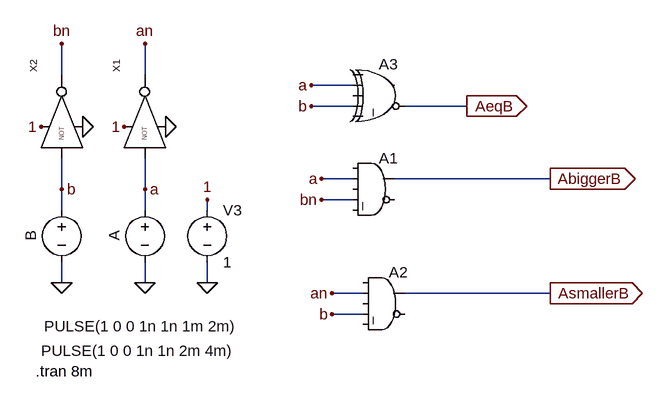
[diagram p0: schematic 1-bit comparator.asc]
1-bit comparator.asc, the LTspice schematic file:
Version 4
SHEET 1 992 680
WIRE -320 144 -320 96
WIRE -192 144 -192 96
WIRE 128 160 64 160
WIRE 128 192 64 192
WIRE 304 192 208 192
WIRE 128 304 80 304
WIRE 432 304 192 304
WIRE -320 320 -320 272
WIRE -192 320 -192 272
WIRE 128 336 80 336
WIRE -320 352 -320 320
WIRE -192 352 -192 320
WIRE -96 352 -96 336
WIRE -320 464 -320 432
WIRE -192 464 -192 432
WIRE -96 464 -96 432
WIRE 144 480 96 480
WIRE 432 480 208 480
WIRE 144 512 96 512
FLAG -192 464 0
FLAG -320 464 0
FLAG -96 464 0
FLAG 304 192 AeqB
IOPIN 304 192 Out
FLAG 432 304 AbiggerB
IOPIN 432 304 Out
FLAG 432 480 AsmallerB
IOPIN 432 480 Out
FLAG 64 160 a
FLAG 64 192 b
FLAG -352 224 1
FLAG -224 224 1
FLAG -96 336 1
FLAG -320 96 bn
FLAG -192 96 an
FLAG -192 320 a
FLAG -320 320 b
FLAG -288 224 0
FLAG -160 224 0
FLAG 80 304 a
FLAG 80 336 bn
FLAG 96 480 an
FLAG 96 512 b
SYMBOL voltage -192 336 R0
WINDOW 0 -32 56 VBottom 2
WINDOW 3 -7 179 Top 2
WINDOW 123 0 0 Left 0
WINDOW 39 0 0 Left 0
SYMATTR InstName A
SYMATTR Value PULSE(1 0 0 1n 1n 1m 2m)
SYMBOL voltage -320 336 R0
WINDOW 0 -32 56 VBottom 2
WINDOW 3 117 217 Top 2
WINDOW 123 0 0 Left 0
WINDOW 39 0 0 Left 0
SYMATTR InstName B
SYMATTR Value PULSE(1 0 0 1n 1n 2m 4m)
SYMBOL Digital\\and 160 256 R0
SYMATTR InstName A1
SYMBOL Digital\\and 176 432 R0
SYMATTR InstName A2
SYMBOL Digital\\xor 176 112 R0
SYMATTR InstName A3
SYMBOL NOT4 -304 208 R270
SYMATTR InstName X2
SYMBOL voltage -96 336 R0
WINDOW 123 0 0 Left 0
WINDOW 39 0 0 Left 0
SYMATTR InstName V3
SYMATTR Value 1
SYMBOL NOT4 -176 208 R270
SYMATTR InstName X1
TEXT -360 600 Left 2 !.tran 8m

The netlist it stands for:
* 1-bit comparator.asc
V§A a 0 PULSE(1 0 0 1n 1n 1m 2m)
V§B b 0 PULSE(1 0 0 1n 1n 2m 4m)
A1 0 a 0 bn 0 0 AbiggerB 0 AND
A2 0 an 0 b 0 0 AsmallerB 0 AND
A3 0 a 0 b 0 AeqB 0 0 XOR
XX2 b 1 0 bn NOT4  ; pins A VH VL OUT
V3 1 0 1
XX1 a 1 0 an NOT4  ; pins A VH VL OUT
.tran 8m
.backanno
.end

* Results of the author's LTspice run, read from the files saved beside the schematic
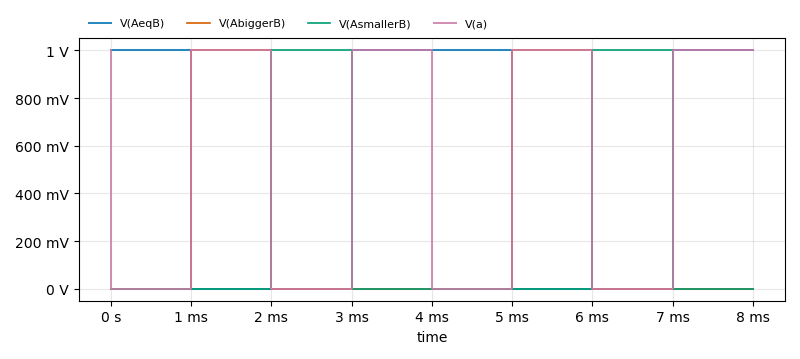
[diagram p1: Transient Analysis of 1-bit comparator.asc, plotted from the saved traces]
* Transient Analysis, 1 run:
*   V(AeqB): min 0 V, max 1 V, average 500 mV, rms 707.1 mV, last 1 V
*   V(AbiggerB): min 0 V, max 1 V, average 250 mV, rms 500 mV, last 0 V
*   V(AsmallerB): min 0 V, max 1 V, average 250 mV, rms 500 mV, last 0 V
*   V(a): min 0 V, max 1 V, average 500 mV, rms 707.1 mV, last 1 V